# EAGLE design power mux-v6 (EAGLE 6.5.0)
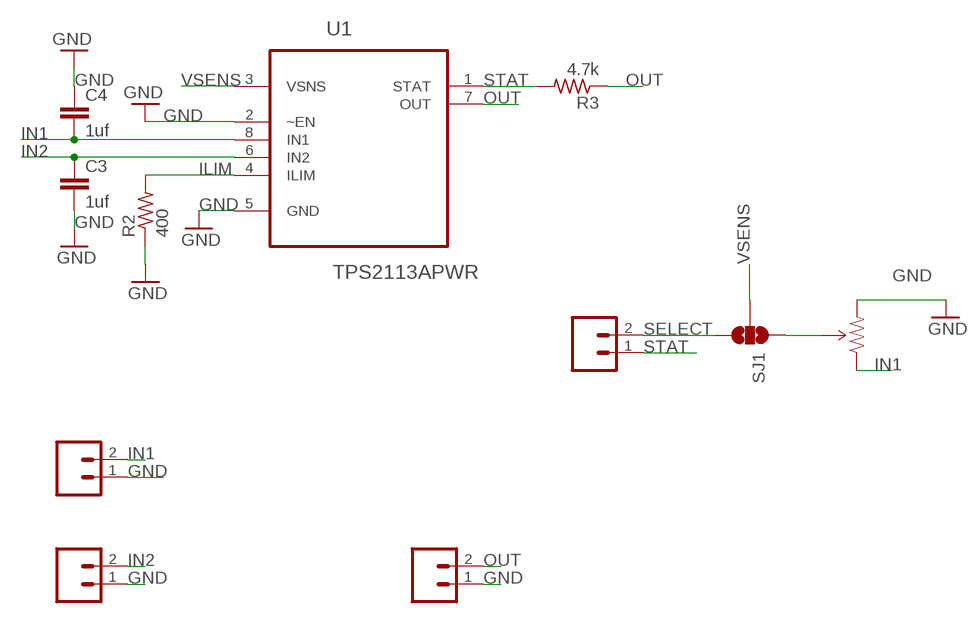
[diagram p0: schematic, sheet 1]

## Parts
C3  1uf  CAP0402-CAP  [0402-CAP]
C4  1uf  CAP0402-CAP  [0402-CAP]
JP3  M021X02_NO_SILK  [1X02_NO_SILK]
JP4  M021X02_NO_SILK  [1X02_NO_SILK]
JP5  M021X02_NO_SILK  [1X02_NO_SILK]
JP6  M021X02_NO_SILK  [1X02_NO_SILK]
R1  TRIMPOT-PTH-KNOB  [3386U]
R2  400  R-US_R0402  [R0402]
R3  4.7k  R-US_R0402  [R0402]
SJ1  SOLDERJUMPER_2WAYPASTE1&2  [SJ_3_PASTE1&2]
U1  TPS2113APWR  [SOP65P640X120-8N]

## Nets
GND: C3.2 C4.1 JP3.1 JP4.1 JP6.1 R1.3(CW) R2.1 U1.2(~EN) U1.5(GND)
ILIM: R2.2 U1.4(ILIM)
IN1: C4.2 JP3.2 R1.1(CCW) U1.8(IN1)
IN2: C3.1 JP4.2 U1.6(IN2)
N$2: R1.2(WIPER) SJ1.1
OUT: JP6.2 R3.1 U1.7(OUT)
SELECT: JP5.2 SJ1.3
STAT: JP5.1 R3.2 U1.1(STAT)
VSENS: SJ1.2 U1.3(VSNS)

## Library data of the parts
C3 C4 = SparkFun-Capacitors:CAP: Capacitor Standard 0603 ceramic capacitor, and 0.1" leaded capacitor.
JP3-JP6 = SparkFun-Connectors:M02: Standard 2-pin 0.1" header. Use with - straight break away headers ( PRT-00116) - right angle break away headers (PRT-00553) - swiss pins (PRT-00743) - machine pins (PRT-00117) - female headers (PRT-00115) Molex polarized connector foot print use with: PRT-08233 with associated crimp pins and housings. 2.54_SCREWTERM for use with PRT-10571. 3.5mm Screw Terminal footprints for PRT-08084 5mm Screw Terminal footprints for use with PRT-08433
R1 = SparkFun-Electromechanical:TRIMPOT: Various small potentiometers for "set-and-forget" applications
R2 R3 = resistor:R-US_: RESISTOR, American symbol
SJ1 = SparkFun-Passives:SOLDERJUMPER_2WAY: Solder Jumper 2 way solder jumper
U1 = Texas Instruments_By_element14_Batch_1:TPS2113APWR: AUTOSWITCHING POWER MUX; MPN: TPS2113APWR; OC_FARNELL: 1757288; OC_NEWARK: 01J0961; PACKAGE: TSSOP-8; SUPPLIER: TEXAS INSTRUMENTS

## Board
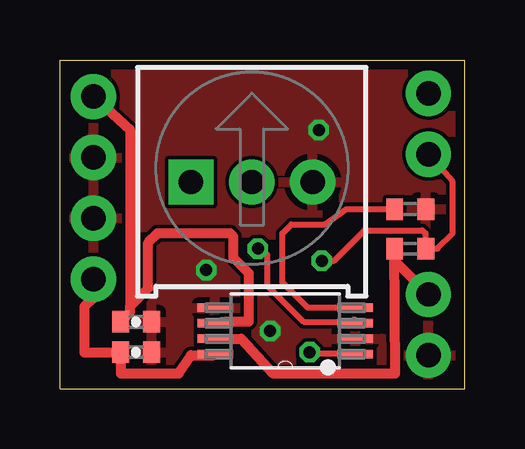
[diagram p1: board, top side]
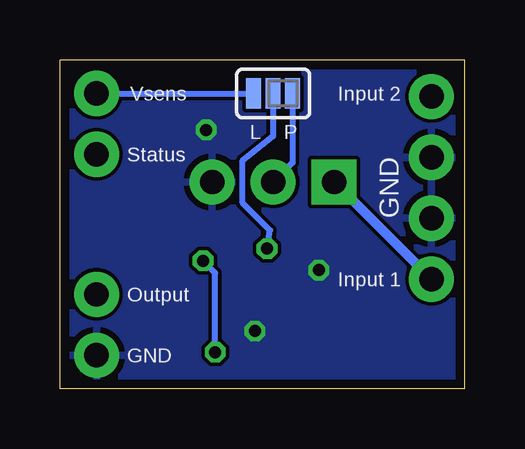
[diagram p2: board, bottom side, seen from below]

Size 16.89 x 13.72 mm. Coordinates in mm from the lower left corner, seen from the top.
Outline: 0,0 0,13.72 16.89,13.72 16.89,0 0,0
Copper layers (1*16): Top 0.0356mm / dielectric 1.5011mm / Bottom 0.0356mm
Design rules "LaenPCBOrder": minimum track width 6mil, minimum drill 13mil, track to track 6mil, track to pad 6mil, pad to pad 6mil, via to via 6mil, smd to smd 6mil, copper to edge 15mil, drill to drill 6mil, minimum pad ring 7mil, minimum via ring 7mil, stop-mask expansion 3mil, vias tented up to drill 0mil, thermal gap 10mil

### Footprints (pad centres in the part's own frame; a part is rotated, then mirrored left to right if it is on the bottom)
0402-CAP = smd 0.7 x 0.9: 1 -0.65,0; 2 0.65,0
1X02_NO_SILK = drill 1.016 pad 1.88: 1 0,0; 2 2.54,0
3386U = drill 1.016 pad 1.88 square: 1 -2.54,-0.015 | drill 1.016 pad 1.88: 2 0,-0.015; 3 2.54,-0.015
R0402 = smd 0.7 x 0.9: 1 -0.65,0; 2 0.65,0
SJ_3_PASTE1&2 = smd 0.635 x 1.27: 1 -0.813,0; 2 0,0; 3 0.813,0
SOP65P640X120-8N = smd 1.473 x 0.356: 1 -2.921,0.965; 2 -2.921,0.33; 3 -2.921,-0.33; 4 -2.921,-0.965; 5 2.921,-0.965; 6 2.921,-0.33; 7 2.921,0.33; 8 2.921,0.965

### Placement (x,y rotation side)
C3  3.17,2.79 0 top
C4  3.17,1.52 180 top
JP3  1.4,7.11 270 top
JP4  1.4,9.65 90 top
JP5  15.37,9.78 90 top
JP6  15.37,1.4 90 top
R1  8,8.64 0 top
R2  14.61,7.49 180 top
R3  14.61,5.84 0 top
SJ1  8,12.32 180 bottom
U1  9.4,2.41 180 top

### Tracks (layer width: path | path; a pad name or v marks a point on that pad's centre or on a via)
GND  (via drill 0.5)
  other vias: 8.76,2.41 6.1,4.95 10.79,10.79
  pour Top: 0,0 16.89,0 16.89,13.59 0,13.59
  pour Bottom: 0.13,13.59 0,0 16.76,0.13 16.89,13.72
ILIM
  Top 0.254: U1.4 10.34,3.38 9.27,4.45 9.27,6.48 9.65,6.86 11.05,6.86 11.94,7.49 R2.2
IN1
  Top 0.406: JP3.2 1.4,3.81 1.02,3.43 1.02,1.51 C4.2 2.52,1.38 2.54,0.64 4.95,0.64 5.46,1.4 6.43,1.4 U1.8
  Bottom 0.406: R1.1 5.45,8.62 JP3.2
IN2
  Top 0.406: U1.6 6.91,2.79 7.87,2.79 7.87,4.83 7.24,5.46 7.24,6.35 7.11,6.48 4.06,6.48 3.68,6.1 3.68,4.19 2.92,3.43 | JP4.2 2.92,10.79 2.92,3.43 | 2.67,2.81 C3.1 2.92,3.19 2.92,3.43
N$2
  Bottom 0.254: SJ1.1 7.19,9.43 R1.2
OUT
  Top 0.406: U1.7 7.57,2.08 8.89,0.64 13.98,0.64 R3.1 13.96,5.35 JP6.2
SELECT
  Bottom 0.254: JP5.2 SJ1.3
STAT  (via drill 0.5)
  Top 0.254: U1.1 10.49,1.45 v10.41,1.52 | v10.92,5.33 11.43,5.33 12.7,6.6 15.11,6.6 15.24,6.48 15.24,5.86 R3.2 15.75,5.84 16.38,6.48 16.38,8.64 JP5.1
  Bottom 0.254: v10.41,1.52 10.41,4.83 v10.92,5.33
VSENS  (via drill 0.5)
  Top 0.254: v8.26,5.84 8.64,5.59 8.64,4.32 10.16,2.79 12.27,2.79
  Top 0.406: 12.27,2.79 U1.3
  Bottom 0.254: SJ1.2 8,10.54 9.27,9.53 9.27,7.75 8.13,6.6 v8.26,5.84

### Text on the board
bPlace: Input 2 | Vsens | P | L | Status | GND | Input 1 | Output | GND